# Altium schematic sheet Communication_V1.1.SchDoc: Data ACQ for 4-20mA Inputs
size A4; DrawnBy: Lin; Engineer: Lin; DocumentNumber: 02; Revision: V1.1; SheetNumber: 2; SheetTotal: 2
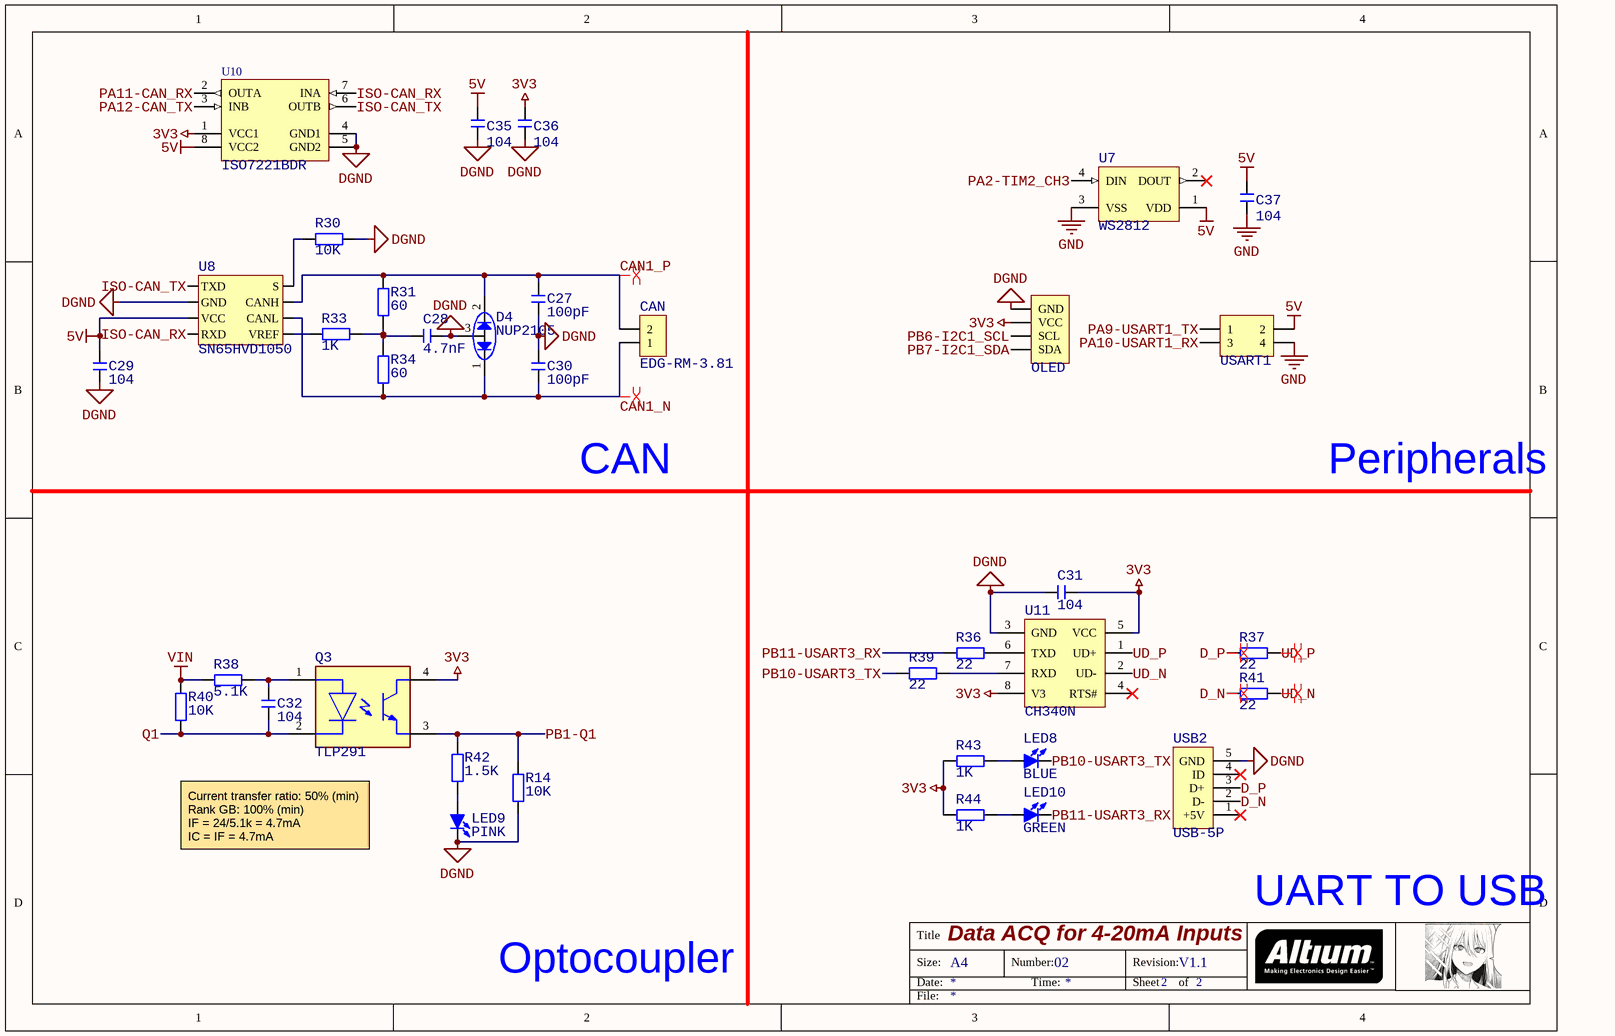
[diagram p0: Communication_V1.1.SchDoc]

## Parts
C27  100pF  [C 0603_L]
C28  4.7nF  [C 0603_L]
C29  104  [C 0603_L]
C30  100pF  [C 0603_L]
C31  104  [C 0603_L]
C32  104  [C 0603_L]
C35  104  [C 0603_L]
C36  104  [C 0603_L]
C37  104  [C 0603_L]
CAN  EDG-RM-3.81  [15EDGRM-02P-3.81mm]
D4  NUP2105  [SOT23-3L]
LED8  BLUE  [LED 0603B]
LED9  PINK  [LED 0603R]
LED10  GREEN  [LED 0603G]
OLED  HDR-1X4  [OLED_0.96寸-LI-4P]  (value not drawn)
Q3  TLP291  [Everlight_EL3H7-G_MFG]
R14  10K  [R 0603_L]
R30  10K  [R 0603_L]
R31  60  [R 0603_L]
R33  1K  [R 0603_L]
R34  60  [R 0603_L]
R36  22  [R 0603_L]
R37  22  [R 0603_L]
R38  5.1K  [R 0603_L]
R39  22  [R 0603_L]
R40  10K  [R 0603_L]
R41  22  [R 0603_L]
R42  1.5K  [R 0603_L]
R43  1K  [R 0603_L]
R44  1K  [R 0603_L]
U7  WS2812  [WS2812B_B]
U8  SN65HVD1050  [SOP8_L]
U10  ISO7221BDR  [SOP8_L]
U11  CH340N  [SOP8_N]
USART1  Header2X2  [HDR2.54-M-LS-2x2P]  (value not drawn)
USB2  USB-5P  [USB-MICRO_E]

## Nets
3V3: C31.1 C36.1 OLED.2(VCC) Q3.4(C) R43.1 R44.1 U10.1(VCC1) U11.5(VCC) U11.8(V3)
5V: C29.2 C35.1 C37.1 U7.1(VDD) U8.3(VCC) U10.8(VCC2) USART1.2
DGND: C27.1 C28.2 C29.1 C30.2 C31.2 C35.2 C36.2 D4.3 LED9.2(K) OLED.1(GND) R14.2 R30.2 U8.2(GND) U10.4(GND1) U10.5(GND2) U11.3(GND) USB2.5(GND)
GND: C37.2 U7.3(VSS) USART1.4
VIN: R38.2 R40.1
CAN1_N: C30.1 CAN.1 D4.1 R34.1 U8.6(CANL)
CAN1_P: C27.2 CAN.2 D4.2 R31.2 U8.7(CANH)
D_N: R41.1 USB2.2(D-)
D_P: R37.1 USB2.3(D+)
ISO-CAN_RX: U8.4(RXD) U10.7(INA)
ISO-CAN_TX: U8.1(TXD) U10.6(OUTB)
PA2-TIM2_CH3: U7.4(DIN)
PA9-USART1_TX: USART1.1
PA10-USART1_RX: USART1.3
PA11-CAN_RX: U10.2(OUTA)
PA12-CAN_TX: U10.3(INB)
PB1-Q1: Q3.3(E) R14.1 R42.1
PB6-I2C1_SCL: OLED.3(SCL)
PB7-I2C1_SDA: OLED.4(SDA)
PB10-USART3_TX: LED8.2(K) R39.1
PB11-USART3_RX: LED10.2(K) R36.1
Q1: C32.2 Q3.2(C) R40.2
UD_N: R41.2 U11.2(UD-)
UD_P: R37.2 U11.1(UD+)
NetC28_1: C28.1 R31.1 R33.1 R34.2
NetC32_1: C32.1 Q3.1(A) R38.1
NetLED8_1: LED8.1(A) R43.2
NetLED9_1: LED9.1(A) R42.2
NetLED10_1: LED10.1(A) R44.2
NetR30_1: R30.1 U8.8(S)
NetR33_2: R33.2 U8.5(VREF)
NetR36_2: R36.2 U11.6(TXD)
NetR39_2: R39.2 U11.7(RXD)

Not connected (* = marked no-connect by the designer): U7 2(DOUT)*; U11 4(RTS#)*; USB2 1(+5V)* 4(ID)*

## Layout directives
differential pair: CAN1_N, CAN1_P, D_N, D_P, UD_N, UD_P

## Notes on the sheet
- CAN
- Peripherals
- Current transfer ratio: 50% (min)
  Rank GB: 100% (min)
  IF = 24/5.1k = 4.7mA
  IC = IF = 4.7mA
- UART TO USB
- Optocoupler
- Title
- Size:
- Date:
- A4
- Number:
- Time:
- Revision:
- Sheet
- of
- File:

## Library data of the parts
C27-C32 C35-C37 = C: 无极性贴片电容; 材质: X7R; BOM名称: 无极性贴片电容
CAN = 绿头卧式2P: 3.81间距
D4 = BAT54A: 表贴肖特基二极管; BOM名称: 肖特基二极管; 属性: 30V/0.2A
LED8-LED10 = LED-SMD: 贴片LED; BOM名称: 贴片LED
OLED = OLED_I2C_128*64: OLED-4P接插件; BOM名称: 4P接插件
Q3 = EL3H7_C_TA_-VG: Optocoupler DC-IN 1-CH Transistor DC-OUT 4-Pin SSOP T/R
R14 R30 R31 R33 R34 R36-R44 = R: 贴片电阻; BOM名称: 贴片电阻
U7 = WS2812: Intelligent Control LED Integrated Light Source, 3.5 to 5.3 V, -25 to 80 degC, 4-Pin SMD, RoHS, Bulk; PartNumber: WS2812B; Current Rating: 240 mA; Tolerance: 10%; Shielding: Unshielded; Case\Package: Radial; RoHSCompliant: true; Min Operating Temperature: -55 degC; Max Operating Temperature: 125 degC; Pins: 2; REACH SVHC: No SVHC; ComponentLink2Description: Datasheet; DatasheetVersion: May-13; ComponentLink1URL: https://www.adafruit.com/; ComponentLink2URL: https://cdn-shop.adafruit.com/datasheets/WS2812B.pdf; PackageReference: WS2812B; ComponentLink1Description: Manufacturer URL; Mount: Through Hole; Length: 12.2 mm; Radiation Hardening: No; Lead Pitch: 5 mm; Package Quantity: 200; Height: 12.2 mm; Packaging: Bulk; PackageDescription: 4-Pin Surface Mount Device, Body 5 x 5 mm, Pitch 3.3 mm
U8 = SN65HVD1050: EMC Optimized CAN Bus Transceiver
U10 = ISO7221BDR: 5 Mbps Dual Channels, 1 / 1, Digital Isolator, 3.3 V / 5 V, -40 to +125 degC, 8-pin SOIC (D), Green (RoHS & no Sb/Br); Manufacturer: Texas Instruments; Supply Voltage(s)(V): 3.3, 5; Insulation Rating(VRMS): 2500; TTL/CMOS Input Threshold: TTL; Rating: Catalog; Input Noise Filter: Yes; Datarate(Mbps): 5; Eco-Plan: Green (RoHS & no Sb/Br); PartNumber: ISO7221BDR; SubFamily: Isolator; ComponentLink1Description: Datasheet; ComponentLink2Description: URL Link1; DatasheetVersion: SLLS755L; ComponentLink1URL: http://www.ti.com/general/docs/lit/getliterature.tsp?genericPartNumber=ISO7221B&fileType=pdf; Code_JEDEC: MS-012AA; ComponentLink2URL: SamplesURL:http://www.ti.com/product/iso7221b#samples; PackageVersion: revM, Jun-2011; Channel Configuration: 02/01/2000; Thermal Shutdown: No; Mounting Technology: Surface Mount; PackageReference: D8; PackageDescription: 8-Pin Plastic Small Outline Integrated Circuit, 4.9 x 3.9 mm, Pitch 1.27 mm Pitch
U11 = CH340N: USB转串口芯片 / Full speed USB 2.0; PartNumber: TPS54232D; Manufacturer: Texas Instruments; Iq(Typ)(mA): 0.11; Vin(Min)(V): 3.5; Switch Current Limit(Typ)(A): 2.3; Eco-Plan: Green (RoHS & no Sb/Br); Duty Cycle(Max)(%): 90; SubFamily: Step-Down Regulator; Vout(Min)(V): 0.8; Vin(Max)(V): 28; Regulated Outputs(#): 1; Rating: Catalog; Vout(Max)(V): 25; Iout(Max)(A): 2; Topology: Buck; PackageReference: D8; ComponentLink1Description: Datasheet; ComponentLink2Description: URL Link1; DatasheetVersion: SLVS876B; ComponentLink1URL: http://www.ti.com/general/docs/lit/getliterature.tsp?genericPartNumber=TPS54232&fileType=pdf; Code_JEDEC: MS-012AA; ComponentLink2URL: Samples URL:http://www.ti.com/product/tps54232#samples; PackageVersion: revM, Jun-2011; Mounting Technology: Surface Mount; PackageDescription: 8-Pin Plastic Small Outline Integrated Circuit, 4.9 x 3.9 mm, Pitch 1.27 mm Pitch
USART1 = Header 2X2: 2*2P接插件; BOM名称: 2*2P接插件
USB2 = USB-5P: 微型USB母座; BOM名称: 微型USB母座